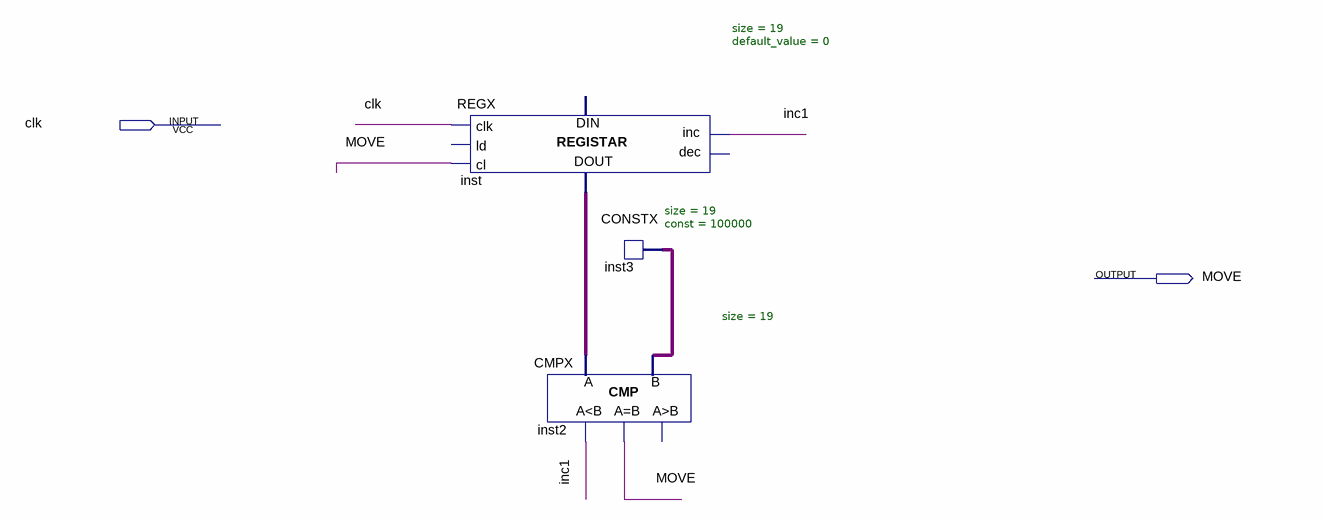
[diagram p0: schematic sheet]
// Quartus schematic tajmer.bdf as structural Verilog: 3 symbols, 2 pins
module tajmer (
  input  clk,
  output MOVE
);

  wire inc1;
  wire [18:0] inst3_data, inst_data_out;

  REGX #(.size(19), .default_value(0)) inst (
    .clk(clk), .cl(MOVE), .inc(inc1), .data_out(inst_data_out));  // open: ld, dec, data_in
  CONSTX #(.size(19), .\const (100000)) inst3 (.data(inst3_data));
  CMPX #(.size(19)) inst2 (.A(inst_data_out), .B(inst3_data), .ls(inc1), .eq(MOVE));  // open: gr
endmodule
